# EAGLE design SigGen (EAGLE 7.7.0)
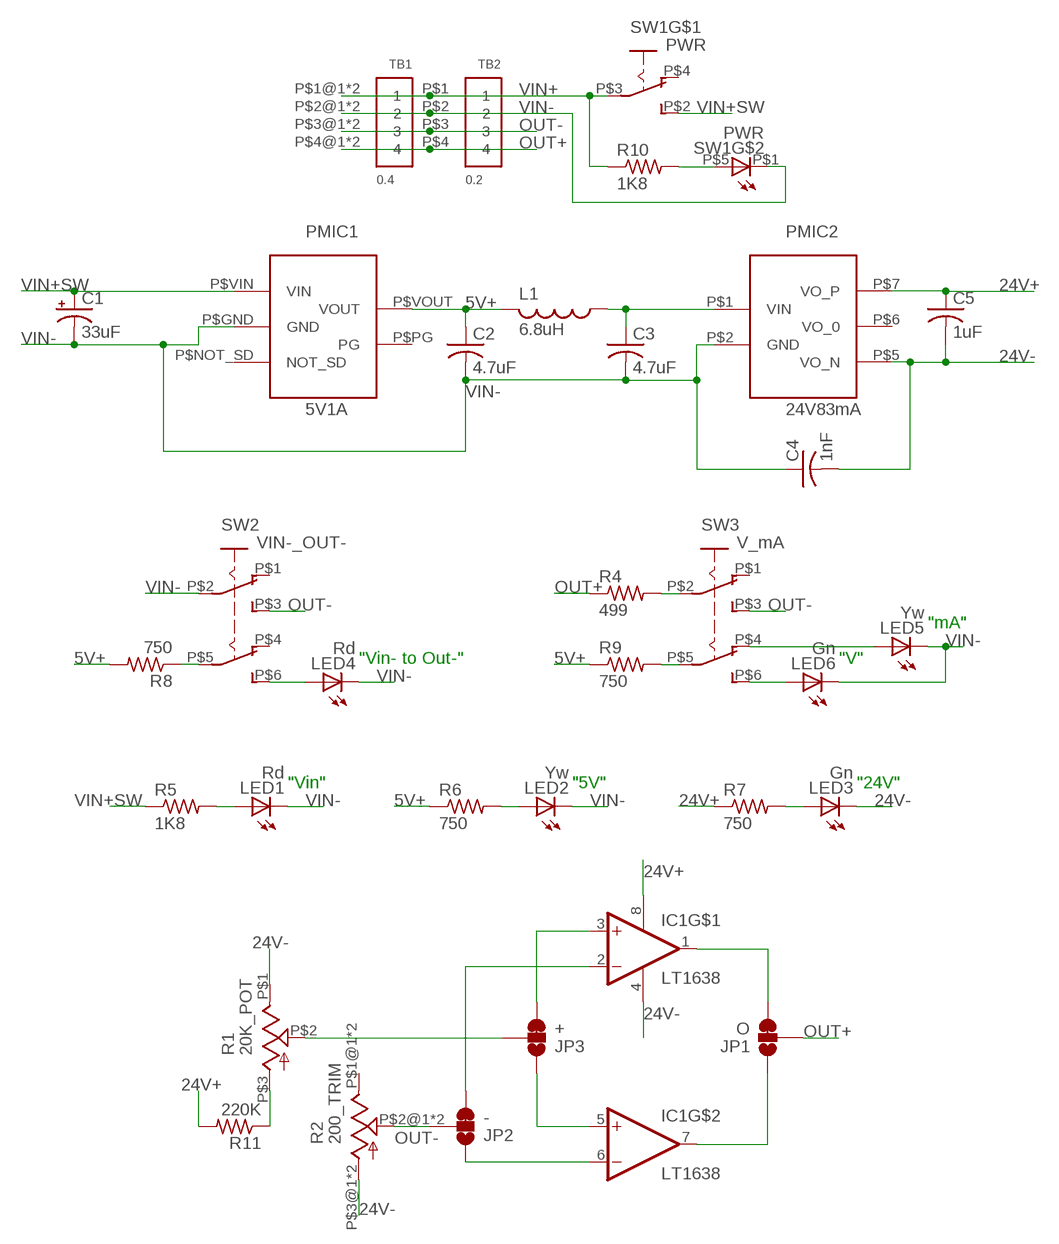
[diagram p0: schematic, sheet 1]

## Parts
C1  33uF  ECE-A1HKA330  [CAP_0.315D]
C2  4.7uF  C-US025-024X044  [C025-024X044]
C3  4.7uF  C-US025-024X044  [C025-024X044]
C4  1nF  C-US075-032X103  [C075-032X103]
C5  1uF  C-US050-024X044  [C050-024X044]
IC1  LT1638  [DIP8]
JP1  O  JUMPER-SMT_3_1-NC_TRACE_NO-SILK  [SMT-JUMPER_3_1-NC_TRACE_NO-SILK]
JP2  -  JUMPER-SMT_3_1-NC_TRACE_NO-SILK  [SMT-JUMPER_3_1-NC_TRACE_NO-SILK]
JP3  +  JUMPER-SMT_3_1-NC_TRACE_NO-SILK  [SMT-JUMPER_3_1-NC_TRACE_NO-SILK]
L1  6.8uH  11R682C  [IND_0.197D]
LED1  Rd  LED3MM  [LED3MM]
LED2  Yw  LED3MM  [LED3MM]
LED3  Gn  LED3MM  [LED3MM]
LED4  Rd  LED3MM  [LED3MM]
LED5  Yw  LED3MM  [LED3MM]
LED6  Gn  LED3MM  [LED3MM]
PMIC1  5V1A  D24V10F5  [PMIC_POLOLU-5X7]
PMIC2  24V83mA  PEM2-S5-S24-S  [PMIC_PEM2-S]
R1  20K_POT  PDB181-K  [POT_PDB181-K]
R2  200_TRIM  89PR  [POT_89]
R4  499  R-US_0204/7  [0204/7]
R5  1K8  R-US_0204/7  [0204/7]
R6  750  R-US_0204/7  [0204/7]
R7  750  R-US_0204/7  [0204/7]
R8  750  R-US_0204/7  [0204/7]
R9  750  R-US_0204/7  [0204/7]
R10  1K8  R-US_0204/7  [0204/7]
R11  220K  R-US_0204/7  [0204/7]
SW1  PWR  ELUMEETH  [ELUM_SWITCH_TH_ILLUMINATED]
SW2  VIN-_OUT-  TL2201  [SW_TL2201]
SW3  V_mA  TL2201  [SW_TL2201]
TB1  0.4  691411610004  [1X04_LARGE_10.16MM]
TB2  0.2  VI0421550000G  [1X04_LARGE_5.08MM]

## Nets
5V+: C2.1 L1.P$2 PMIC1.P$VOUT(VOUT) R6.1 R8.2 R9.1
24V+: C5.1 IC1.8(V+) PMIC2.P$7(VO_P) R7.1 R11.2
24V-: C4.2 C5.2 IC1.4(V-) LED3.K(C) PMIC2.P$5(VO_N) R1.P$1(CCW) R2.P$3@1(CW) R2.P$3@2(CW)
N$1: LED1.A R5.2
N$2: C3.1 L1.P$1 PMIC2.P$1(VIN)
N$3: R8.1 SW2.P$5(COM2)
N$4: LED2.A R6.2
N$5: LED3.A R7.2
N$6: R4.2 SW3.P$2(COM1)
N$7: LED4.A SW2.P$6(NO2)
N$8: R9.2 SW3.P$5(COM2)
N$9: LED6.A SW3.P$6(NO2)
N$10: LED5.A SW3.P$4(NC2)
N$11: R1.P$3(CW) R11.1
N$12: JP3.2 R1.P$2(WIPER)
N$13: IC1.7(OUT) JP1.1
N$14: R10.2 SW1.P$5(A)
N$15: IC1.1(OUT) JP1.3
N$16: IC1.3(+IN) JP3.3
N$17: IC1.5(+IN) JP3.1
N$18: IC1.2(-IN) JP2.3
N$19: IC1.6(-IN) JP2.1
OUT+: JP1.2 R4.1 TB1.P$4@1 TB1.P$4@2 TB2.P$4
OUT-: JP2.2 R2.P$2@1(WIPER) R2.P$2@2(WIPER) SW2.P$3(NO1) SW3.P$3(NO1) TB1.P$3@1 TB1.P$3@2 TB2.P$3
VIN+: R10.1 SW1.P$3(COM) TB1.P$1@1 TB1.P$1@2 TB2.P$1
VIN+SW: C1.P$2_POS(+) PMIC1.P$VIN(VIN) R5.1 SW1.P$2(NO)
VIN-: C1.P$1_NEG(-) C2.2 C3.2 C4.1 LED1.K(C) LED2.K(C) LED4.K(C) LED5.K(C) LED6.K(C) PMIC1.P$GND(GND) PMIC2.P$2(GND) SW1.P$1(C) SW2.P$2(COM1) TB1.P$2@1 TB1.P$2@2 TB2.P$2
Unconnected: PMIC1.P$NOT_SD(NOT_SD) PMIC1.P$PG(PG) PMIC2.P$6(VO_0) R2.P$1@1(CCW) R2.P$1@2(CCW) SW1.P$4(NC) SW2.P$1(NC1) SW2.P$4(NC2) SW3.P$1(NC1)

## Notes on the sheet
- "mA"
- "Vin- to Out-" | "V"
- "Vin" | "5V" | "24V"

## Library data of the parts
C1 = MyParts:ECE-A1HKA330: ECE-A1HKA330 Electrolytic Cap Radial 0.315"D
C2-C5 = adafruit:C-US: CAPACITOR, American symbol
IC1 = MyParts:LT1638: LT1638 Dual Op-Amps
JP1-JP3 = SparkFun-Jumpers:JUMPER-SMT_3_1-NC_TRACE: Normally closed trace jumper (1 of 2 connections) This jumper has a trace between two pads so it's normally closed (NC). The other connection is normally open (NO). Use a razor knife to open the connection. For best results follow the IPC guidelines for cutting traces: Cutout at least 0.063 mm (0.005 in). Remove all loose material to clean up the cut area. Seal the cut with an approved epoxy. Reapply solder to reclose the connection, or to close the NO connection.
L1 = MyParts:11R682C: 11R682C Inductor Axial 0.197"D
LED1-LED6 = adafruit:LED: LED OSRAM: - CHIPLED LG R971, LG N971, LY N971, LG Q971, LY Q971, LO R971, LY R971 LH N974, LH R974 LS Q976, LO Q976, LY Q976 LO Q996 - Hyper CHIPLED LW Q18S LB Q993, LB Q99A, LB R99A - SideLED LS A670, LO A670, LY A670, LG A670, LP A670 LB A673, LV A673, LT A673, LW A673 LH A674 LY A675 LS A676, LA A676, LO A676, LY A676, LW A676 LS A679, LY A679, LG A679 - Hyper Micro SIDELED® LS Y876, LA Y876, LO Y876, LY Y876 LT Y87S - SmartLED LW L88C, LW L88S LB L89C, LB L89S, LG L890 LS L89K, LO L89K, LY L89K LS L896, LA L896, LO L896, LY L896 - TOPLED LS T670, LO T670, LY T670, LG T670, LP T670 LSG T670, LSP T670, LSY T670, LOP T670, LYG T670 LG T671, LOG T671, LSG T671 LB T673, LV T673, LT T673, LW T673 LH T674 LS T676, LA T676, LO T676, LY T676, LB T676, LH T676, LSB T676, LW T676 LB T67C, LV T67C, LT T67C, LS T67K, LO T67K, LY T67K, LW E67C LS E67B, LA E67B, LO E67B, LY E67B, LB E67C, LV E67C, LT E67C LW T67C LS T679, LY T679, LG T679 LS T770, LO T770, LY T770, LG T770, LP T770 LB T773, LV T773, LT T773, LW T773 LH T774 LS E675, LA E675, LY E675, LS T675 LS T776, LA T776, LO T776, LY T776, LB T776 LHGB T686 LT T68C, LB T68C - Hyper Mini TOPLED® LB M676 - Mini TOPLED Santana® LG M470 LS M47K, LO M47K, LY M47K Source: http://www.osram.convergy.de/
PMIC1 = MyParts:D24V10F5: D24V10F5 Pololu 5V1A Step-Down Vreg
PMIC2 = MyParts:PEM2-S5-S24-S: PEM2-S5-S24-S DC/DC Converter 5V in, 24V@83mA out
R1 = MyParts:PDB181-K: PDB181-K Potentiometer
R2 = MyParts:89PR: 89PR Trim Potentiometer
R4-R11 = adafruit:R-US_: RESISTOR, American symbol
SW1 = MyParts:ELUMEETH
SW2 SW3 = MyParts:TL2201: TL2201 Switch DPDT
TB1 = MyParts:691411610004: 691411610004 4-position Terminal Block 10.16mm/0.4" pitch
TB2 = MyParts:VI0421550000G: VI0421550000G 4-position Terminal Block 5.08mm/0.2" pitch

## Board
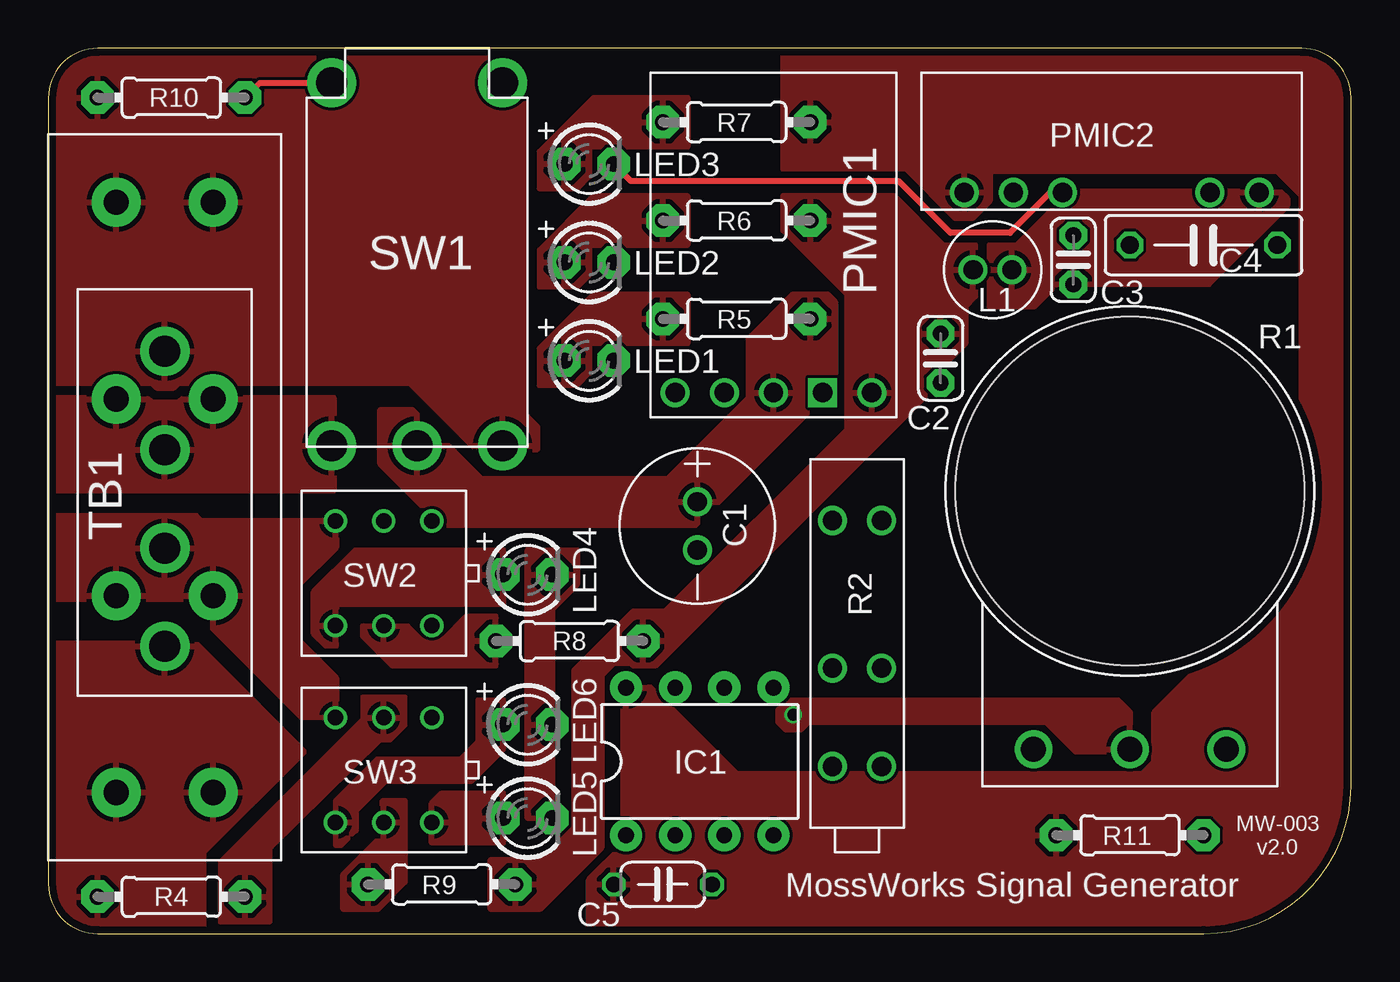
[diagram p1: board, top side]
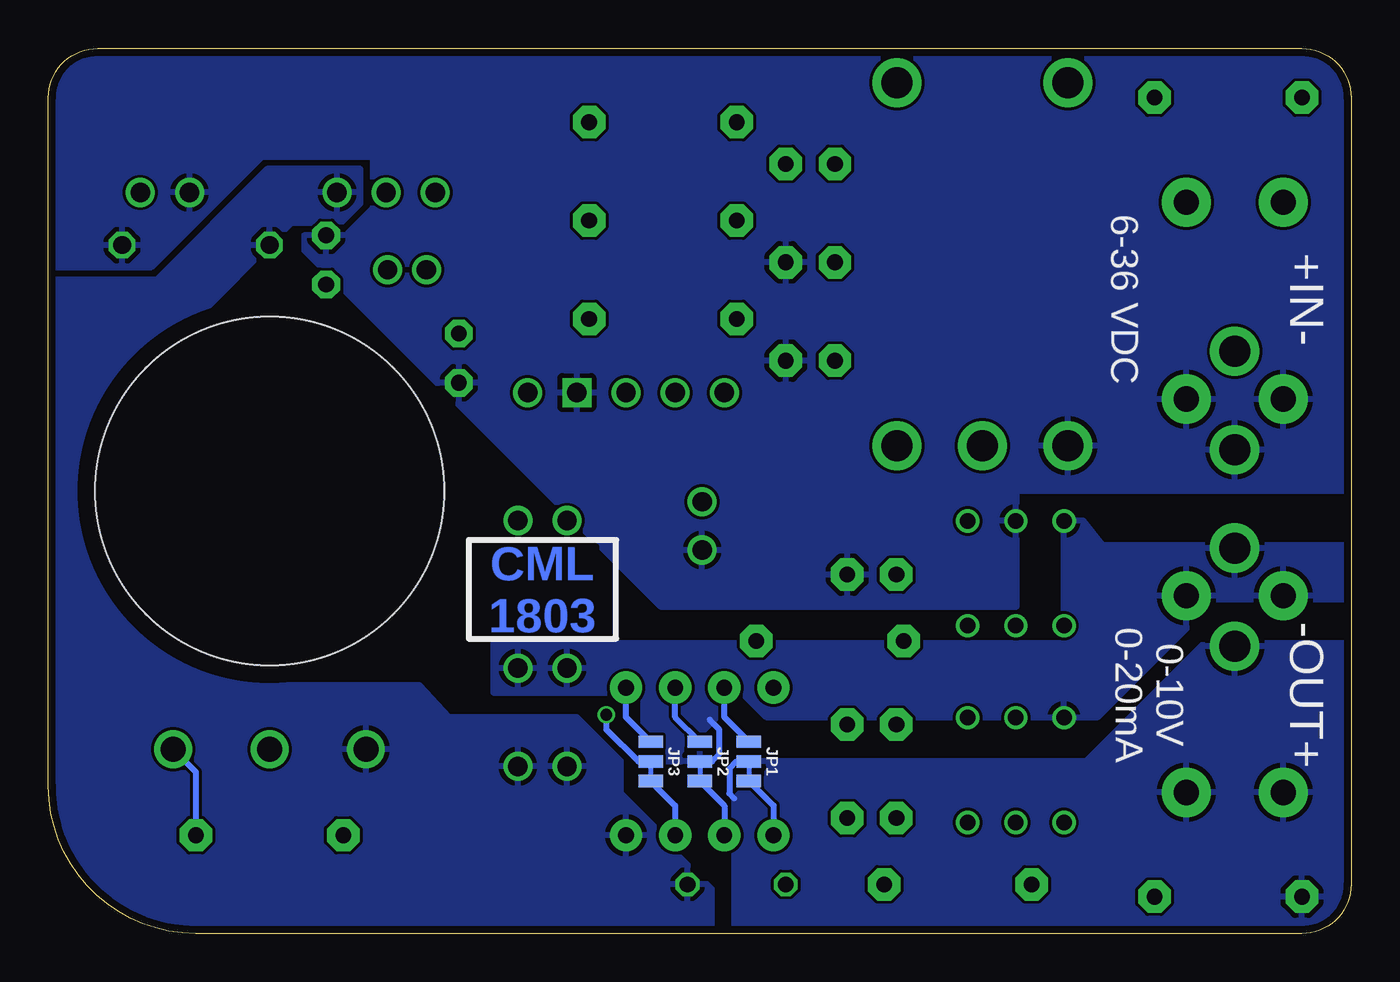
[diagram p2: board, bottom side, seen from below]

Size 67.31 x 45.72 mm. Coordinates in mm from the lower left corner, seen from the top.
Outline: 0,43.18 0,2.54 arc90 2.54,0 59.69,0 arc90 67.31,7.62 67.31,43.18 arc90 64.77,45.72 2.54,45.72 arc90 0,43.18
Copper layers (1*16): Top 0.035559375mm / dielectric 1.6mm / Bottom 0.035559375mm
Design rules "oshpark-2layer": minimum track width 6mil, minimum drill 10mil, track to track 6mil, track to pad 6mil, pad to pad 6mil, via to via 6mil, smd to smd 6mil, copper to edge 15mil, drill to drill 6mil, minimum pad ring 5mil, minimum via ring 5mil, stop-mask expansion 2.5mil, vias tented up to drill 0mil, thermal gap 10mil
tRestrict: area 46.5,13.5 to 65.3,32.3
bRestrict: area 46.5,13.5 to 65.3,32.3

### Footprints (pad centres in the part's own frame; a part is rotated, then mirrored left to right if it is on the bottom)
CAP_0.315D = drill 1: P$1_NEG 0,0; P$2_POS 2.489,0
C025-024X044 = drill 0.813 pad 1.422 octagon: 1 -1.27,0; 2 1.27,0
C075-032X103 = drill 0.914 octagon: 1 -3.81,0; 2 3.81,0
C050-024X044 = drill 0.813 octagon: 1 -2.54,0; 2 2.54,0
DIP8 = drill 0.813 pad 1.676: 1 -3.81,-3.81; 2 -1.27,-3.81; 3 1.27,-3.81; 4 3.81,-3.81; 5 3.81,3.81; 6 1.27,3.81; 7 -1.27,3.81; 8 -3.81,3.81
SMT-JUMPER_3_1-NC_TRACE_NO-SILK = smd 0.635 x 1.27: 1 -1.016,0; 2 0,0; 3 1.016,0
IND_0.197D = drill 1: P$1 0,0; P$2 2.007,0
LED3MM = drill 0.813 pad 1.676 octagon: A -1.27,0; K 1.27,0
PMIC_POLOLU-5X7 = drill 1 square: P$GND 8.89,1.27 | drill 1: P$NOT_SD 3.81,1.27; P$PG 1.27,1.27; P$VIN 6.35,1.27; P$VOUT 11.43,1.27
PMIC_PEM2-S = drill 1: P$1 2.21,6.172; P$2 4.75,6.172; P$5 12.37,6.172; P$6 14.91,6.172; P$7 17.45,6.172
POT_PDB181-K = drill 1.3: P$1 -4.978,-13.335; P$2 0,-13.335; P$3 4.978,-13.335 | hole 18.009: 0,0
POT_89 = drill 1: P$1@1 3.175,3.683; P$1@2 3.175,1.143; P$2@1 10.795,1.143; P$2@2 10.795,3.683; P$3@1 15.875,3.683; P$3@2 15.875,1.143
0204/7 = drill 0.813 pad 1.676 octagon: 1 -3.81,0; 2 3.81,0
ELUM_SWITCH_TH_ILLUMINATED = drill 1.6 pad 2.54: P$1 20.523,1.295; P$2 20.523,5.715; P$3 20.523,10.135; P$4 1.778,10.135; P$5 1.778,1.295
SW_TL2201 = drill 0.8: P$1 1.778,1.549; P$2 4.267,1.549; P$3 6.756,1.549; P$4 1.778,6.96; P$5 4.267,6.96; P$6 6.756,6.96
1X04_LARGE_10.16MM = drill 1.3 pad 2.54: P$1@1 3.505,3.505; P$1@2 3.505,8.509; P$2@1 13.665,3.505; P$2@2 13.665,8.509; P$3@1 23.825,3.505; P$3@2 23.825,8.509; P$4@1 33.985,3.505; P$4@2 33.985,8.509
1X04_LARGE_5.08MM = drill 1.6 pad 2.54: P$1 3.2,4.496; P$2 8.28,4.496; P$3 13.36,4.496; P$4 18.44,4.496

### Placement (x,y rotation side)
C1  33.53,19.81 90 top
C2  46.1,29.72 270 top
C3  52.96,34.8 90 top
C4  59.69,35.56 180 top
C5  31.75,2.54 0 top
IC1  33.66,8.89 0 top
JP1  31.11,8.89 270 bottom
JP2  33.66,8.89 270 bottom
JP3  36.2,8.89 270 bottom
L1  49.78,34.29 180 top
LED1  27.94,29.59 0 top
LED2  27.94,34.67 0 top
LED3  27.94,39.75 0 top
LED4  24.77,18.54 0 top
LED5  24.77,5.97 0 top
LED6  24.77,10.79 0 top
PMIC1  31.11,26.67 0 top
PMIC2  64.77,44.45 180 top
R1  55.88,22.86 0 top
R2  39.37,24.51 270 top
R4  6.35,1.91 0 top
R5  35.56,31.75 180 top
R6  35.56,36.83 180 top
R7  35.56,41.91 180 top
R8  26.92,15.11 0 top
R9  20.32,2.54 180 top
R10  6.35,43.18 0 top
R11  55.88,5.08 180 top
SW1  13.34,45.72 270 top
SW2  21.59,22.86 180 top
SW3  21.59,12.7 180 top
TB1  0,41.27 270 top
TB2  1.52,33.27 270 top

### Tracks (layer width: path | path; a pad name or v marks a point on that pad's centre or on a via)
5V+
  pour Top: 37.97,38.1 43.69,38.1 46.23,35.56 47.88,35.56 47.88,32.89 47.37,32.38 47.37,30.48 45.72,28.83 45.72,28.19 31.37,13.84 30.23,13.84 30.1,13.97 29.21,13.97 28.57,13.34 28.57,4.45 25.4,1.27 22.86,1.27 22.86,3.81 25.53,3.81 27.18,5.46 27.18,13.59 30.23,16.64 31.88,16.64 41.27,26.04 41.27,33.02 37.97,36.32
24V+
  pour Top: 27.94,0 27.94,2.79 29.72,4.57 29.72,12.83 30.99,12.83 35.56,8.26 56.52,8.26 57.15,8.89 57.15,11.43 64.77,19.05 64.77,38.1 63.5,39.37 48.64,39.37 48.64,37.85 47.75,36.96 46.86,36.96 44.32,39.5 37.97,39.5 37.97,45.72 67.31,45.72 67.31,0
24V-
  Top 0.305: LED3.K 30.1,38.86 43.94,38.86 46.61,36.2 49.68,36.2 51.77,38.28 PMIC2.P$5
  pour Bottom: 33.02,0 33.02,2.29 35.56,4.83 35.56,5.08 37.72,7.24 37.72,8.89 40.01,11.18 46.61,11.18 48.13,12.83 55.88,12.83 60.33,31.11 54.74,36.7 52.2,36.7 51.18,37.72 51.18,39.5 56.01,39.5 61.72,33.78 67.31,33.78 67.31,0
N$1
  pour Top: 27.3,28.32 25.4,28.32 25.4,30.23 28.19,33.02 33.02,33.02 33.02,30.48 27.94,30.48 27.94,28.96
N$2
  pour Top: 48.64,35.56 50.04,35.56 52.83,38.35 63.63,38.35 64.01,37.97 64.01,37.59 59.94,33.53 52.07,33.53 50.93,32.38 48.64,32.38
N$3
  pour Top: 23.11,16.38 23.11,13.84 17.78,13.84 16.26,15.37 16.26,15.88 18.54,15.88 19.18,15.24 20.45,15.24 21.59,16.38
N$4
  pour Top: 27.3,33.4 25.4,33.4 25.4,35.31 28.19,38.1 33.02,38.1 33.02,35.56 27.94,35.56 27.94,34.04
N$5
  pour Top: 27.3,38.48 25.4,38.48 25.4,40.39 28.19,43.18 33.02,43.18 33.02,40.64 27.94,40.64 27.94,39.12
N$6
  pour Top: 8.89,0.64 11.43,0.64 11.43,4.45 17.14,10.03 17.65,10.03 18.41,10.79 18.41,12.19 16.26,12.19 16.26,11.05 8.89,3.68
N$7
  pour Top: 23.5,19.81 23.5,17.02 14.86,17.02 14.86,14.86 14.35,14.86 13.72,15.49 13.72,17.65 15.88,19.81
N$8
  pour Top: 15.24,1.27 15.24,3.05 17.27,5.08 17.27,6.86 18.41,6.86 18.41,2.67 17.02,1.27
N$9
  pour Top: 23.5,12.06 23.5,9.53 21.84,7.87 17.4,7.87 15.88,6.35 15.88,5.33 15.11,4.57 14.86,4.57 14.86,6.86 17.02,9.02 21.34,9.02 22.23,9.91 22.23,12.06
N$10
  Top 0.305: 23.27,5.74 LED5.A
  pour Top: 19.81,4.7 19.81,6.73 20.32,7.24 23.5,7.24 23.5,4.7
N$11
  Bottom 0.305: R1.P$3 59.69,8.36 R11.1
N$12  (via drill 0.6)
  Bottom 0.305: JP3.2 36.83,8.89 38.48,10.54 v38.48,11.3
  pour Top: 38.1,10.54 37.72,10.92 37.72,11.56 38.23,12.06 55.24,12.06 55.88,11.43 55.88,9.4 53.09,9.4 51.56,10.92 39.24,10.92 38.86,10.54
N$13
  Bottom 0.305: JP1.1 32.38,11.18 IC1.7
N$14
  Top 0.305: R10.2 10.92,43.94 SW1.P$5
N$15
  Bottom 0.305: JP1.3 29.84,6.6 IC1.1
N$16
  Bottom 0.305: JP3.3 34.92,6.6 IC1.3
N$17
  Bottom 0.305: JP3.1 37.47,11.18 IC1.5
N$18
  Bottom 0.305: JP2.3 32.38,6.6 IC1.2
N$19
  Bottom 0.305: JP2.1 34.92,11.18 IC1.6
OUT+
  Bottom 0.305: JP1.2 31.75,8.89 32.13,8.51 32.13,7.24 31.88,6.99
  pour Bottom: 0,0 0,14.99 7.62,14.99 13.72,8.89 31.11,8.89 31.11,7.75 31.88,6.99 31.88,0
  pour Top: 0,0 0,14.99 7.62,14.99 13.21,9.4 8,4.19 8,0
OUT-
  Bottom 0.305: JP2.2 33.02,8.89 32.64,9.27 32.64,10.54 33.15,11.05
  pour Bottom: 0,17.27 0,20.07 12.83,20.07 13.84,21.34 14.86,21.34 14.86,14.99 44.32,14.99 44.32,12.45 36.58,12.45 36.58,8.89 33.66,8.89 33.66,10.29 32.77,11.18 32.77,12.7 31.75,12.7 30.23,11.18 13.08,11.18 8.13,16.13 8.13,17.27
  pour Top: 0,21.59 7.62,21.59 7.87,21.34 14.86,21.34 14.86,19.94 12.95,18.03 12.95,15.11 14.86,13.21 14.86,11.18 13.08,11.18 6.99,17.27 0,17.27
VIN+
  pour Top: 0,45.72 0,28.45 5.33,28.45 5.59,28.19 6.48,28.19 6.73,28.45 18.67,28.45 22.1,25.02 25.27,25.02 25.27,26.16 24.64,26.8 24.64,45.72
VIN+SW
  pour Top: 17.14,27.05 18.8,27.05 22.35,23.5 32,23.5 36.2,27.69 36.2,30.73 38.48,33.02 40.26,33.02 40.64,32.64 40.64,28.32 33.4,21.08 20.32,21.08 17.14,24.26
VIN-
  pour Bottom: 54.1,35.31 35.69,16.89 17.27,16.89 17.27,22.86 0,22.86 0,45.72 67.31,45.72 67.31,34.42 61.98,34.42 56.26,40.13 50.55,40.13 50.55,37.47 51.94,36.07 54.1,36.07
  pour Top: 26.04,5.97 24.77,5.97 24.77,19.81 27.3,19.81 27.3,18.03 26.04,16.76
  pour Top: 0,22.86 0,27.69 5.08,27.69 5.33,27.43 6.73,27.43 6.99,27.69 14.73,27.69 14.73,22.86

### Text on the board
Bottom: CML / 1803
tNames: PMIC1 | SW1 | TB1 | MW-003 / v2.0 | MossWorks Signal Generator
bNames: +IN- | 6-36 VDC | -OUT+ | 0-10V / 0-20mA